# Altium schematic sheet card.SchDoc
size A4
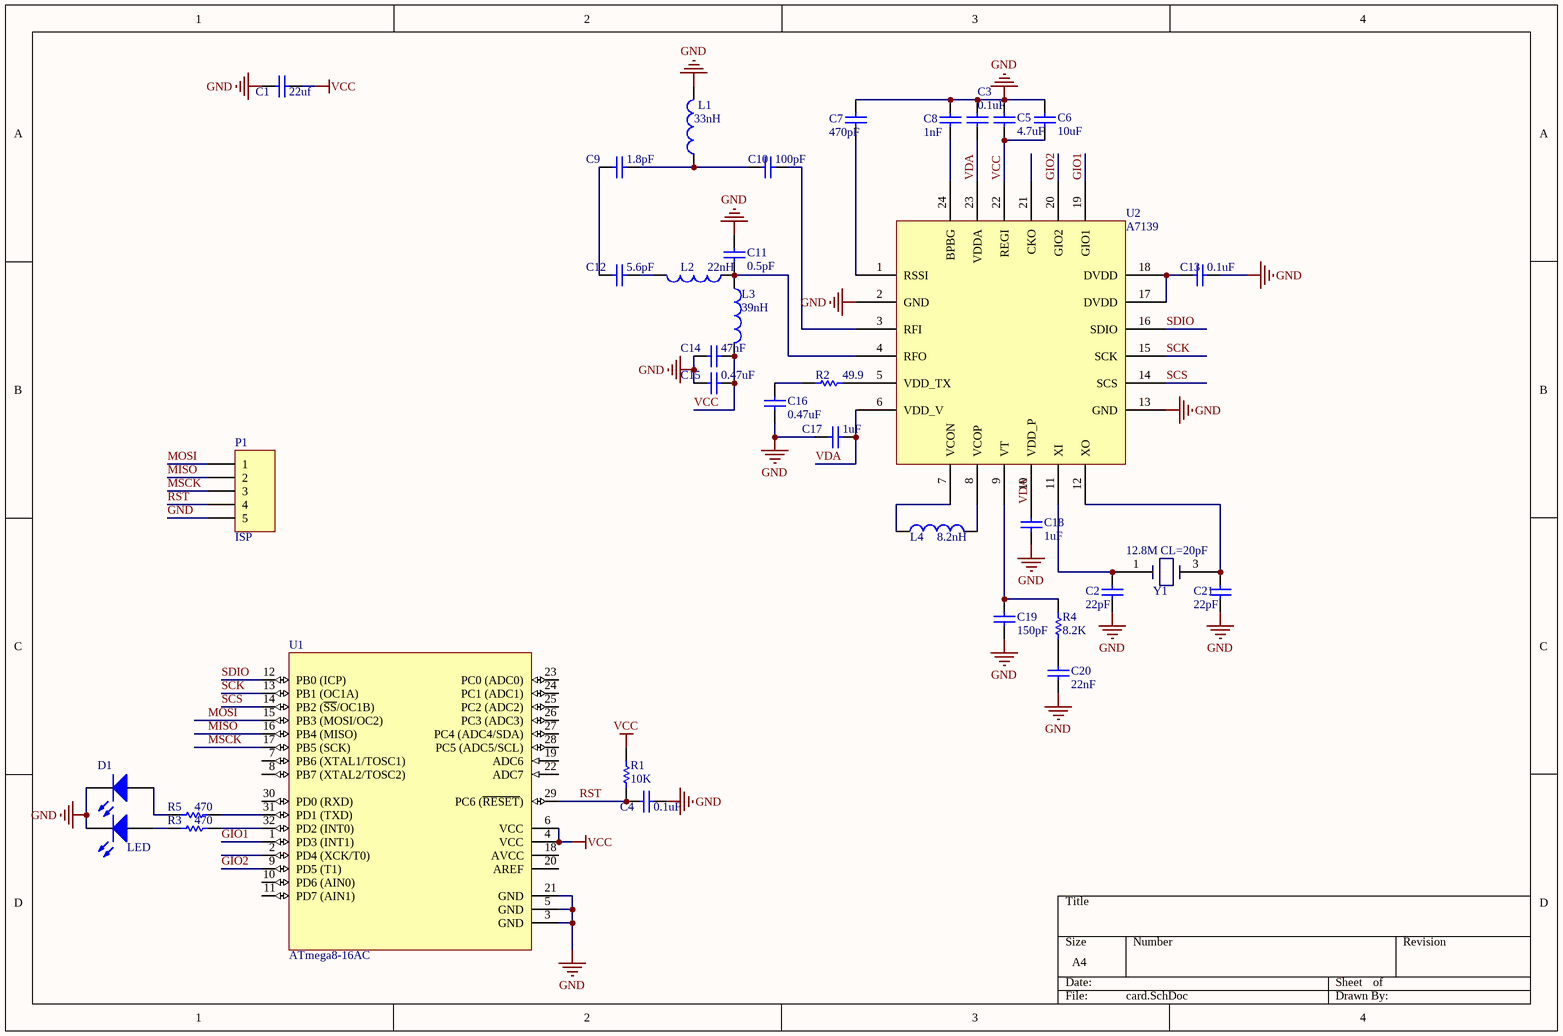
[diagram p0: card.SchDoc]

## Parts
C1  value 22uf  [3216[1206]]  (hidden comment: Cap)
C2  value 22pF  [0402-A]  (hidden comment: Cap)
C3  value 0.1uF  [0402-A]  (hidden comment: Cap)
C4  value 0.1uF  [0603]  (hidden comment: Cap)
C5  value 4.7uF  [0603]  (hidden comment: Cap)
C6  value 10uF  [0603]  (hidden comment: Cap)
C7  value 470pF  [0402-A]  (hidden comment: Cap)
C8  value 1nF  [0402-A]  (hidden comment: Cap)
C9  value 1.8pF  [0402-A]  (hidden comment: Cap)
C10  value 100pF  [0402-A]  (hidden comment: Cap)
C11  value 0.5pF  [0402-A]  (hidden comment: Cap)
C12  value 5.6pF  [0402-A]  (hidden comment: Cap)
C13  value 0.1uF  [0402-A]  (hidden comment: Cap)
C14  value 47nF  [0402-A]  (hidden comment: Cap)
C15  value 0.47uF  [0402-A]  (hidden comment: Cap)
C16  value 0.47uF  [0402-A]  (hidden comment: Cap)
C17  value 1uF  [0402-A]  (hidden comment: Cap)
C18  value 1uF  [0402-A]  (hidden comment: Cap)
C19  value 150pF  [0402-A]  (hidden comment: Cap)
C20  value 22nF  [0402-A]  (hidden comment: Cap)
C21  value 22pF  [0402-A]  (hidden comment: Cap)
D1  LED  [0603-LED-DOUBLE]
L1  value 33nH  [0603]  (hidden comment: Inductor)
L2  value 22nH  [0603]  (hidden comment: Inductor)
L3  value 39nH  [0603]  (hidden comment: Inductor)
L4  value 8.2nH  [0402-A]  (hidden comment: Inductor)
P1  ISP  [HDR1X5]
R1  value 10K  [0603]  (hidden comment: Res1)
R2  value 49.9  [0402-A]  (hidden comment: Res1)
R3  value 470  [0603]  (hidden comment: Res1)
R4  value 8.2K  [0402-A]  (hidden comment: Res1)
R5  value 470  [0603]  (hidden comment: Res1)
U1  ATmega8-16AC  [32A_M]
U2  A7139  [QFN24N]
Y1  12.8M CL=20pF

## Nets
GND: C1.1 C2.1 C3.2 C4.2 C5.2 C6.2 C7.2 C8.2 C11.1 C13.2 C14.2 C15.2 C16.1 C17.2 C18.1 C19.1 C20.1 C21.1 D1.3(K) D1.4(K) L1.2 P1.5 U1.3(GND) U1.5(GND) U1.21(GND) U2.2(GND) U2.13(GND) U2.25(GND)
VCC: C1.2 C5.1 C6.1 C14.1 C15.1 L3.2 R1.2 U1.4(VCC) U1.6(VCC) U2.22(REGI)
GIO1: U1.1(PD3_(INT1)) U2.19(GIO1)
GIO2: U1.9(PD5_(T1)) U2.20(GIO2)
MISO: P1.2 U1.16(PB4_(MISO))
MOSI: P1.1 U1.15(PB3_(MOSI/OC2))
MSCK: P1.3 U1.17(PB5_(SCK))
RST: C4.1 P1.4 R1.1 U1.29(PC6_(~{RESET}))
SCK: U1.13(PB1_(OC1A)) U2.15(SCK)
SCS: U1.14(PB2_(~{SS}/OC1B)) U2.14(SCS)
SDIO: U1.12(PB0_(ICP)) U2.16(SDIO)
VDA: C3.1 C17.1 C18.2 U2.6(VDD_V) U2.10(VDD_P) U2.23(VDDA)
NetC2_2: C2.2 U2.11(XI) Y1.1
NetC7_1: C7.1 U2.1(RSSI)
NetC8_1: C8.1 U2.24(BPBG)
NetC9_1: C9.1 C10.2 L1.1
NetC9_2: C9.2 C12.2
NetC10_1: C10.1 U2.3(RFI)
NetC11_2: C11.2 L2.1 L3.1 U2.4(RFO)
NetC12_1: C12.1 L2.2
NetC13_1: C13.1 U2.17(DVDD) U2.18(DVDD)
NetC16_2: C16.2 R2.2
NetC19_2: C19.2 R4.2 U2.9(VT)
NetC20_2: C20.2 R4.1
NetC21_2: C21.2 U2.12(XO) Y1.3
NetD1_1: D1.1(A) R3.2
NetD1_2: D1.2(A) R5.2
NetL4_1: L4.1 U2.7(VCON)
NetL4_2: L4.2 U2.8(VCOP)
NetR2_1: R2.1 U2.5(VDD_TX)
NetR3_1: R3.1 U1.32(PD2_(INT0))
NetR5_1: R5.1 U1.31(PD1_(TXD))

Not connected (* = marked no-connect by the designer): U1 2(PD4_(XCK/T0)) 7(PB6_(XTAL1/TOSC1)) 8(PB7_(XTAL2/TOSC2)) 10(PD6_(AIN0)) 11(PD7_(AIN1)) 18(AVCC) 19(ADC6) 20(AREF) 22(ADC7) 23(PC0_(ADC0)) 24(PC1_(ADC1)) 25(PC2_(ADC2)) 26(PC3_(ADC3)) 27(PC4_(ADC4/SDA)) 28(PC5_(ADC5/SCL)) 30(PD0_(RXD)); U2 21(CKO)

## Library data of the parts
C1-C21 = Cap: Capacitor; Published: 8-Jun-2000; LatestRevisionDate: 17-Jul-2002; LatestRevisionNote: Re-released for DXP Platform.; PackageReference: RAD-0.3; Publisher: Altium Limited
D1 = LED-DOUBLE: Value: LED
L1-L4 = Inductor: Code_IEC: 1005; Published: 8-Jun-2000; LatestRevisionDate: 17-Jul-2002; LatestRevisionNote: Re-released for DXP Platform.; PackageReference: 0402-A; Publisher: Altium Limited; Code_JEITA: 0402
P1 = Header 5: Header, 5-Pin; LatestRevisionDate: 17-Jul-2002; LatestRevisionNote: Re-released for DXP Platform.; Publisher: Altium Limited
R1-R5 = Res1: Resistor; Published: 8-Jun-2000; LatestRevisionDate: 17-Jul-2002; LatestRevisionNote: Re-released for DXP Platform.; PackageReference: AXIAL-0.3; Publisher: Altium Limited
U1 = ATmega8-16AC: 8-Bit AVR Microcontroller with 8K Bytes of In-System Programmable Flash Memory; Published: 17-Sep-2003; LatestRevisionDate: 13-Apr-2006; LatestRevisionNote: IPC-7351 Footprint Added.; DatasheetVersion: 2486H-AVR-09/02; PackageVersion: revB, Oct-2001; PackageReference: 32A; Publisher: Altium Limited; PackageDescription: 32-Pin Thin Quad Flat Pack 0.8 mm Pitch; Code_JEDEC: MS-026-ABA; ComponentLink1Description: Manufacturer Link; ComponentLink1URL: http://www.atmel.com; ComponentLink2Description: Datasheet; ComponentLink2URL: http://www.atmel.com/dyn/resources/prod_documents/doc2486.pdf
Y1 = 3225-wy